# EAGLE schematic RadioMusic_F (EAGLE 7.2.0)
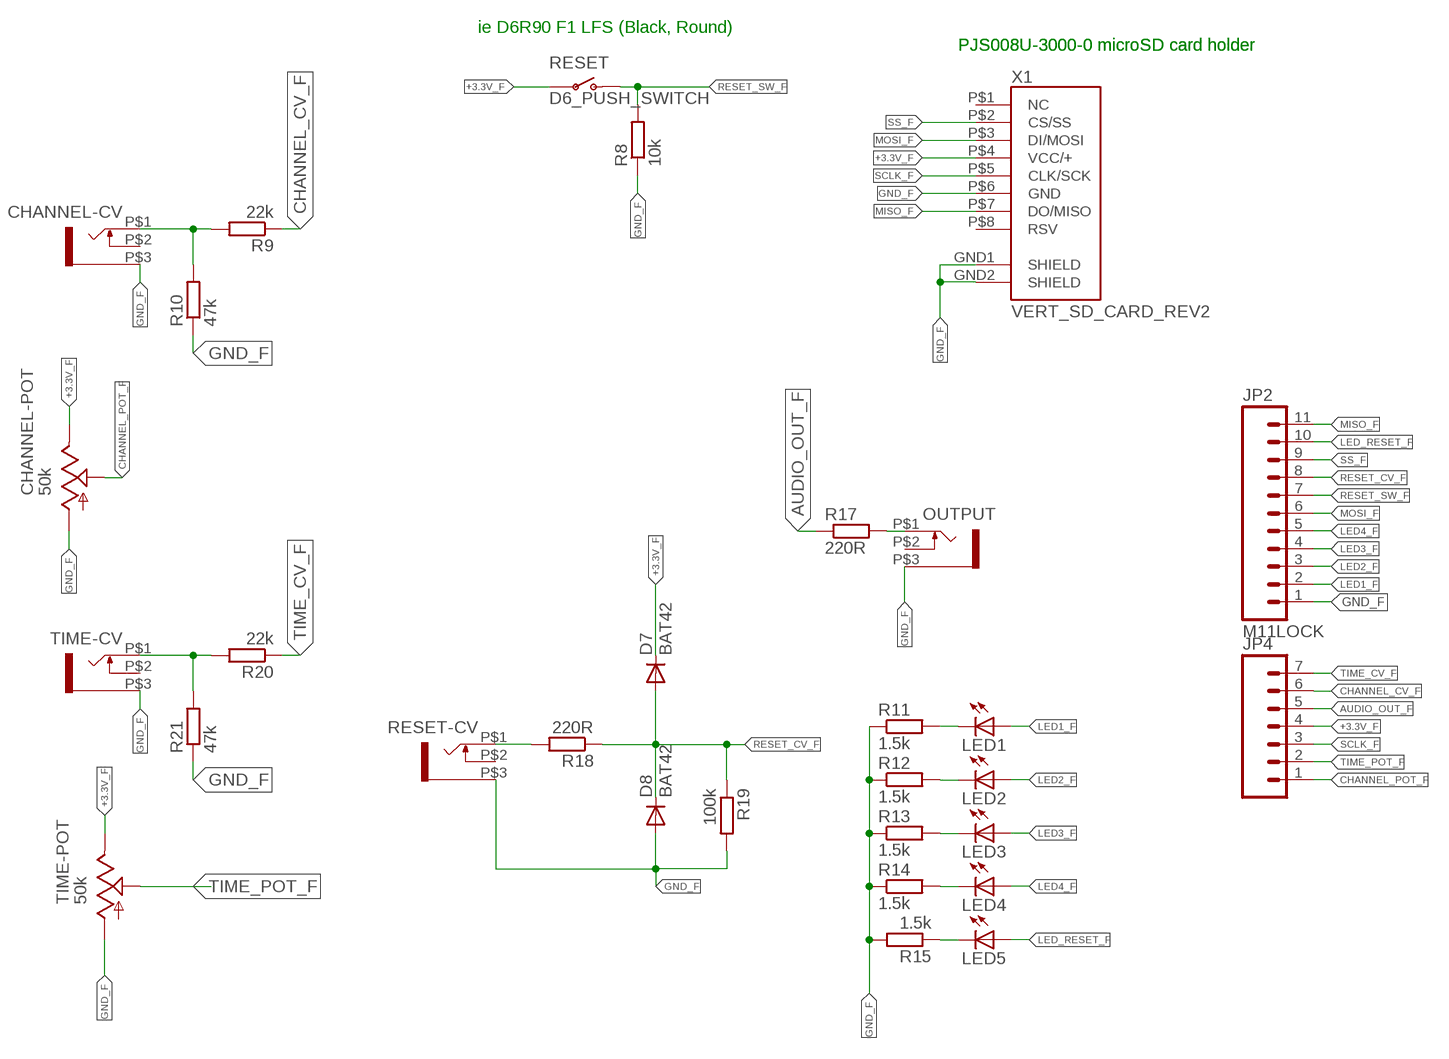
[diagram p0: schematic, sheet 1]

## Parts
CHANNEL-CV  WQP-PJ301M-12_JACK  [WQP-PJ301M-12_JACK]
CHANNEL-POT  50k  ALPHA-9MMF2A  [EVUF]
D7  BAT42  BAT81  [DO34-7]
D8  BAT42  BAT81  [DO34-7]
JP2  M11LOCK  [1X11_LOCK]
JP4  M07LOCK  [1X07_LOCK]
LED1  LED3MM  [LED3MM]
LED2  LED3MM  [LED3MM]
LED3  LED3MM  [LED3MM]
LED4  LED3MM  [LED3MM]
LED5  LED3MM  [LED3MM]
OUTPUT  WQP-PJ301M-12_JACK  [WQP-PJ301M-12_JACK]
R8  10k  R-EU_STANDARD_RESISTOR  [0207/10]
R9  22k  R-EU_STANDARD_RESISTOR  [0207/10]
R10  47k  R-EU_STANDARD_RESISTOR  [0207/10]
R11  1.5k  R-EU_STANDARD_RESISTOR  [0207/10]
R12  1.5k  R-EU_STANDARD_RESISTOR  [0207/10]
R13  1.5k  R-EU_STANDARD_RESISTOR  [0207/10]
R14  1.5k  R-EU_STANDARD_RESISTOR  [0207/10]
R15  1.5k  R-EU_STANDARD_RESISTOR  [0207/10]
R17  220R  R-EU_STANDARD_RESISTOR  [0207/10]
R18  220R  R-EU_STANDARD_RESISTOR  [0207/10]
R19  100k  R-EU_STANDARD_RESISTOR  [0207/10]
R20  22k  R-EU_STANDARD_RESISTOR  [0207/10]
R21  47k  R-EU_STANDARD_RESISTOR  [0207/10]
RESET  D6_PUSH_SWITCH  [D6_BUTTON_RND]
RESET-CV  WQP-PJ301M-12_JACK  [WQP-PJ301M-12_JACK]
TIME-CV  WQP-PJ301M-12_JACK  [WQP-PJ301M-12_JACK]
TIME-POT  50k  ALPHA-9MMF2A  [EVUF]
X1  VERT_SD_CARD_REV2  [VERT_MICROSD_REV2]

## Nets
+3.3V_F: CHANNEL-POT.3(E) D7.C JP4.4 RESET.P$3(P) RESET.P$4(P) TIME-POT.3(E) X1.P$4(VCC/+)
AUDIO_OUT_F: JP4.5 R17.1
CHANNEL_CV_F: JP4.6 R9.1
CHANNEL_POT_F: CHANNEL-POT.2(S) JP4.1
GND_F [ground]: CHANNEL-CV.P$3 CHANNEL-POT.1(A) D8.A JP2.1 OUTPUT.P$3 R8.1 R10.1 R11.1 R12.1 R13.1 R14.1 R15.2 R19.2 R21.1 RESET-CV.P$3 TIME-CV.P$3 TIME-POT.1(A) X1.GND1(SHIELD) X1.GND2(SHIELD) X1.P$6(GND)
LED1_F: JP2.2 LED1.A
LED2_F: JP2.3 LED2.A
LED3_F: JP2.4 LED3.A
LED4_F: JP2.5 LED4.A
LED_RESET_F: JP2.10 LED5.A
MISO_F: JP2.11 X1.P$7(DO/MISO)
MOSI_F: JP2.6 X1.P$3(DI/MOSI)
N$3: OUTPUT.P$1 R17.2
N$9: CHANNEL-CV.P$1 R9.2 R10.2
N$14: R18.2 RESET-CV.P$1
N$18: LED1.K(C) R11.2
N$19: LED2.K(C) R12.2
N$20: LED3.K(C) R13.2
N$21: LED4.K(C) R14.2
N$25: LED5.K(C) R15.1
RESET_CV_F: D7.A D8.C JP2.8 R18.1 R19.1
RESET_SW_F: JP2.7 R8.2 RESET.P$1(O) RESET.P$2(O)
SCLK_F: JP4.3 X1.P$5(CLK/SCK)
SS_F: JP2.9 X1.P$2(CS/SS)
TEMP: R20.2 R21.2 TIME-CV.P$1
TIME_CV_F: JP4.7 R20.1
TIME_POT_F: JP4.2 TIME-POT.2(S)
Unconnected: CHANNEL-CV.P$2 OUTPUT.P$2 RESET-CV.P$2 TIME-CV.P$2 X1.P$1(NC) X1.P$8(RSV)

## Notes on the sheet
- ie D6R90 F1 LFS (Black, Round)
- PJS008U-3000-0 microSD card holder | PJS008U-3000-0 microSD card holder

## Library data of the parts
CHANNEL-CV OUTPUT RESET-CV TIME-CV = thonkiconn:WQP-PJ301M-12_JACK
CHANNEL-POT TIME-POT = TomW:ALPHA-9MM: 9 mm Square Rotary Potentiometers Source: Panasonic
D7 D8 = diode:BAT81: DIODE barrier diode
JP2 = SparkFun-Connectors:M11: Header 11 Standard 11-pin 0.1" header. Use with straight break away headers (SKU : PRT-00116), right angle break away headers (PRT-00553), swiss pins (PRT-00743), machine pins (PRT-00117), and female headers (PRT-00115).
JP4 = SparkFun-Connectors:M07: Header 7 Standard 7-pin 0.1" header. Use with straight break away headers (SKU : PRT-00116), right angle break away headers (PRT-00553), swiss pins (PRT-00743), machine pins (PRT-00117), and female headers (PRT-00115). NOTES ON THE VARIANTS LOCK and LOCK_LONGPADS... This footprint was designed to help hold the alignment of a through-hole component (i.e. 7-pin header) while soldering it into place. You may notice that each hole has been shifted either up or down by 0.005 of an inch from it's more standard position (which is usually a perfectly straight line). This slight alteration caused the pins (the squares in the middle) to touch the edges of the holes. Because they are alternating, it causes a "brace" to hold the header in place. 0.005 has proven to be the perfect amount of "off-center" position when using our standard breakaway headers. Although looks a little odd when you look at the bare footprint, once you have a header in there, the alteration is very hard to notice. Also, if you push a header all the way into place, it is covered up entirely on the bottom side. This idea of altering the position of holes to aid alignment will be further integrated into the Sparkfun Library for other footprints. It can help hold any component with 3 or more connection pins.
LED1-LED5 = TomW:LED: LED OSRAM: - CHIPLED LG R971, LG N971, LY N971, LG Q971, LY Q971, LO R971, LY R971 LH N974, LH R974 LS Q976, LO Q976, LY Q976 LO Q996 - Hyper CHIPLED LW Q18S LB Q993, LB Q99A, LB R99A - SideLED LS A670, LO A670, LY A670, LG A670, LP A670 LB A673, LV A673, LT A673, LW A673 LH A674 LY A675 LS A676, LA A676, LO A676, LY A676, LW A676 LS A679, LY A679, LG A679 - Hyper Micro SIDELED® LS Y876, LA Y876, LO Y876, LY Y876 LT Y87S - SmartLED LW L88C, LW L88S LB L89C, LB L89S, LG L890 LS L89K, LO L89K, LY L89K LS L896, LA L896, LO L896, LY L896 - TOPLED LS T670, LO T670, LY T670, LG T670, LP T670 LSG T670, LSP T670, LSY T670, LOP T670, LYG T670 LG T671, LOG T671, LSG T671 LB T673, LV T673, LT T673, LW T673 LH T674 LS T676, LA T676, LO T676, LY T676, LB T676, LH T676, LSB T676, LW T676 LB T67C, LV T67C, LT T67C, LS T67K, LO T67K, LY T67K, LW E67C LS E67B, LA E67B, LO E67B, LY E67B, LB E67C, LV E67C, LT E67C LW T67C LS T679, LY T679, LG T679 LS T770, LO T770, LY T770, LG T770, LP T770 LB T773, LV T773, LT T773, LW T773 LH T774 LS E675, LA E675, LY E675, LS T675 LS T776, LA T776, LO T776, LY T776, LB T776 LHGB T686 LT T68C, LB T68C - Hyper Mini TOPLED® LB M676 - Mini TOPLED Santana® LG M470 LS M47K, LO M47K, LY M47K Source: http://www.osram.convergy.de LUXEON: - LUMILED® LXK2-PW12-R00, LXK2-PW12-S00, LXK2-PW14-U00, LXK2-PW14-V00 LXK2-PM12-R00, LXK2-PM12-S00, LXK2-PM14-U00 LXK2-PE12-Q00, LXK2-PE12-R00, LXK2-PE12-S00, LXK2-PE14-T00, LXK2-PE14-U00 LXK2-PB12-K00, LXK2-PB12-L00, LXK2-PB12-M00, LXK2-PB14-N00, LXK2-PB14-P00, LXK2-PB14-Q00 LXK2-PR12-L00, LXK2-PR12-M00, LXK2-PR14-Q00, LXK2-PR14-R00 LXK2-PD12-Q00, LXK2-PD12-R00, LXK2-PD12-S00 LXK2-PH12-R00, LXK2-PH12-S00 LXK2-PL12-P00, LXK2-PL12-Q00, LXK2-PL12-R00 Source: www.luxeon.com KINGBRIGHT: KA-3528ASYC Source: www.kingbright.com
R8-R15 R17-R21 = TomW:R-EU_: RESISTOR, European symbol
RESET = TomW:D6_PUSH_SWITCH
X1 = TomW:VERT_SD_CARD_REV2

## Net classes
0 default: width 0.305 mm
1 power: width 0.457 mm
2 ground: width 0.457 mm